# Altium schematic sheet Optocoupler.SchDoc: Optocoupler
size A3; Author: M.Beldyga; CompanyName: WUT ISE; DrawnBy: M.Beldyga; Organization: WUT ISE; Address1: PW ISE; Address2: Nowowiejska 15/19 00-665 Warsaw; Address3: micbeldyga@gmail.com; SheetNumber: 2; SheetTotal: 2; ModifiedBy: -; CheckedDate: -; DivGrp: WUT ISE; Designer: M.Beldyga; ModifiedDate: -; ProjectName: Sensor Box
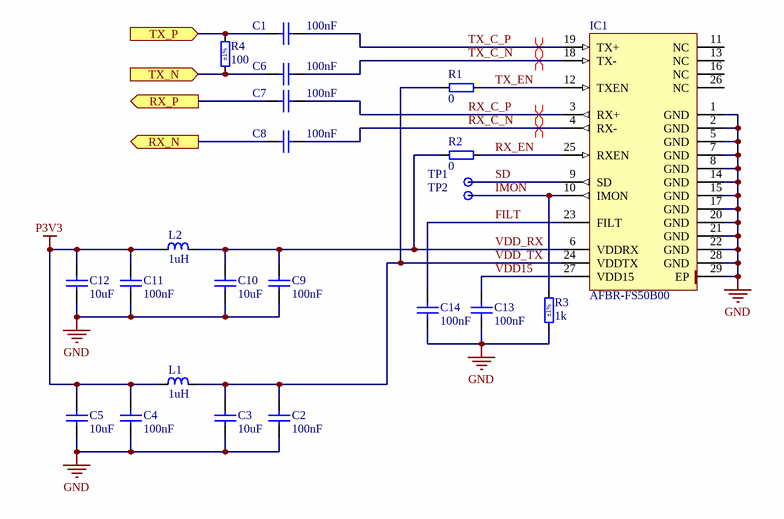
[diagram p0: Optocoupler.SchDoc]

## Parts
C1  100nF  [CAPC1005X55N]
C2  100nF  [CAPC1005X55N]
C3  10uF  [CAPC1005X55N]
C4  100nF  [CAPC1005X55N]
C5  10uF  [CAPC1005X55N]
C6  100nF  [CAPC1005X55N]
C7  100nF  [CAPC1005X55N]
C8  100nF  [CAPC1005X55N]
C9  100nF  [CAPC1005X55N]
C10  10uF  [CAPC1005X55N]
C11  100nF  [CAPC1005X55N]
C12  10uF  [CAPC1005X55N]
C13  100nF  [CAPC1005X55N]
C14  100nF  [CAPC1005X55N]
IC1  AFBR-FS50B00  [BROADCOM_AFBR-FS50B00]
L1  1uH  [INDC1005X55N]
L2  1uH  [INDC1005X55N]
R1  0  [RESC1005X40N]
R2  0  [RESC1005X40N]
R3  1k  Tolerance: ±1%  [RESC1005X40N]
R4  100  Tolerance: ±1%  [RESC1005X40N]
TP1  Test Point  [TPS127]  (value not drawn)
TP2  Test Point  [TPS127]  (value not drawn)

## Ports
RX_N (out), RX_P (out), TX_N (in), TX_P (in)

## Nets
GND: C2.1 C3.1 C4.1 C5.1 C9.1 C10.1 C11.1 C12.1 C13.1 C14.1 IC1.1(GND) IC1.2(GND) IC1.5(GND) IC1.7(GND) IC1.8(GND) IC1.14(GND) IC1.15(GND) IC1.17(GND) IC1.20(GND) IC1.21(GND) IC1.22(GND) IC1.28(GND) IC1.29(EP) R3.1
P3V3: C4.2 C5.2 C11.2 C12.2 L1.2 L2.2
FILT: C14.2 IC1.23(FILT)
IMON: IC1.10(IMON) R3.2 TP2.1
RX_C_N: C8.1 IC1.4(RX-)
RX_C_P: C7.1 IC1.3(RX+)
RX_EN: IC1.25(RXEN) R2.2
RX_N: C8.2 ; port RX_N
RX_P: C7.2 ; port RX_P
SD: IC1.9(SD) TP1.1
TX_C_N: C6.1 IC1.18(TX-)
TX_C_P: C1.1 IC1.19(TX+)
TX_EN: IC1.12(TXEN) R1.2
TX_N: C6.2 R4.1 ; port TX_N
TX_P: C1.2 R4.2 ; port TX_P
VDD15: C13.2 IC1.27(VDD15)
VDD_RX: C9.2 C10.2 IC1.6(VDDRX) L2.1 R2.1
VDD_TX: C2.2 C3.2 IC1.24(VDDTX) L1.1 R1.1

Not connected (* = marked no-connect by the designer): IC1 11(NC) 13(NC) 16(NC) 26(NC)

## Layout directives
differential pair; net class D100: RX_C_N, RX_C_P, TX_C_N, TX_C_P

## Notes on the sheet
- Project/Equipment
- Document
- Designer
- Drawn by
- Check.by
- Contact
- File
- Last Mod.
- Print Date
- Sheet
- Size
- A3
- of
- Rev

## Library data of the parts
C1 C2 C4 C6-C9 C11 C13 C14 = CC0402_100NF_50V_10%_X7R: Non-polarised capacitor; Part Description: SMD Multilayer Chip Ceramic Capacitor; Manufacturer: GENERIC; Manufacturer1 Part Number: GRM155R71H104KE14D; Voltage: 50V; TC: X7R; Tolerance: ±10%; Part Number: CC0402_100NF_50V_10%_X7R; Component Kind: Standard; Component Type: Standard; Pin Count: 2; Value: 100nF; Status: None; Manufacturer Part Number: CC0402_100NF_50V_10%_X7R; Case: 0402; Mounted: Yes; Socket: No; SMD: Yes; Sense: No; Manufacturer1 Example: MURATA; Manufacturer1 ComponentHeight: 0.55mm; HelpURL: \\cern.ch\dfs\Applications\Altium\Datasheets\CC0402_MURATA_GRM155R71H104KE14D.pdf; Author: CERN DEM MR; CreateDate: 6/30/2017; LatestRevisionDate: 6/30/2017
C3 C5 C10 C12 = CC0402_10UF_6.3V_20%_X5R: SMD Mulitlayer Ceramic Chip Capacitor; Manufacturer: GENERIC; Manufacturer 1: Murata; Manufacturer 1 Part Number: GRM155R60J106ME15D; Manufacturer 2 Part Number: CL05A106MQ5NUNC; Manufacturer 3 Part Number: CC0402MRX5R5BB106; Voltage: 6.3V; TC: X5R; Tolerance: ±20%; Part Number: CC0402_10UF_6.3V_20%_X5R; Component Kind: Standard; Component Type: Standard; Pin Count: 2; Value: 10uF; Manufacturer Part Number: CC0402_10UF_6.3V_20%_X5R; Case: 0402; Status: None; ComponentHeight: 0.55mm; SMD: Yes; Manufacturer 2: Samsung; Manufacturer 3: YAGEO; Author: Michal Beldyga; CreateDate: 10/28/2024; LatestRevisionDate: 10/28/2024
IC1 = AFBR-FS50B00: High Voltage Galvanic Insulation Link for DC to 5MBaud; Part Description: Transceiver Module Optical 5Gbps 3.3V Surface Mount; Manufacturer: BROADCOM; PressFit: No; Bonding: No; Part Number: AFBR-FS50B00; Component Kind: Standard; Component Type: Standard; Device: AFBR-FS50B00; PackageDescription: BROADCOM AFBR-FS50B00 Case, Body 5.25mm L X 5.25mm W X 4.83mm H; Manufacturer Part Number: AFBR-FS50B00; Pin Count: 29; Mounted: Yes; Socket: No; SMD: No; Sense: No; ComponentHeight: 4.83mm; HelpURL: \\cern.ch\dfs\Applications\Altium\Datasheets\AFBR-FS50B00.pdf; Author: CERN DEM HF; CreateDate: 12/10/2024; LatestRevisionDate: 12/10/2024
L1 L2 = IND0402_1UH_5%_TDK_MLZ1005M1R0WT000: Inductor; Part Description: FIXED IND 1UH 450MA 350 MOHM SMD; Manufacturer: TDK; Current: 100mA; DC Resistance: 350mΩ; Tolerance: ±20%; Part Number: IND0402_1UH_5%_TDK_MLZ1005M1R0WT000; Component Kind: Standard; Component Type: Standard; Pin Count: 2; Value: 1uH; Manufacturer Part Number: MLZ1005M1R0WT000; Status: Active; ComponentHeight: 0.5mm; SMD: Yes; Author: Michal Beldyga; CreateDate: 2/17/2025; LatestRevisionDate: 2/17/2025
R1 R2 = R0402_0R_JUMPER: Resistor; Part Description: 1A (0.05R Max DC Resistance) Zero Ohm Jumper; Manufacturer: GENERIC; Manufacturer1 Part Number: 232270591001L; PressFit: No; Part Number: R0402_0R_JUMPER; Component Kind: Standard; Component Type: Standard; Pin Count: 2; Value: 0; Status: Not Recommended; Manufacturer Part Number: R0402_0R_JUMPER; Case: 0402; Mounted: Yes; Sense: No; Socket: No; SMD: Yes; Manufacturer1 Example: YAGEO PHYCOMP; Manufacturer1 ComponentHeight: 0.4mm; HelpURL: \\cern.ch\dfs\Applications\Altium\Datasheets\R0402_Phycomp_RC0402.pdf; Author: CERN DEM JLC; CreateDate: 12/3/2007; LatestRevisionDate: 10/17/2012
R3 = R0402_1K_1%_0.0625W_100PPM: Resistor - 1%; Part Description: General Purpose Thick Film Chip Resistor; Manufacturer: GENERIC; Manufacturer1 Part Number: 232270671002L; TC: ±100ppm/°C; PressFit: No; Part Number: R0402_1K_1%_0.0625W_100PPM; Component Kind: Standard; Component Type: Standard; Pin Count: 2; Value: 1k; Status: Not Recommended; Power: 0.0625W; Manufacturer Part Number: R0402_1K_1%_0.0625W_100PPM; Case: 0402; Mounted: Yes; Sense: No; Socket: No; SMD: Yes; Manufacturer1 Example: YAGEO PHYCOMP; Manufacturer1 ComponentHeight: 0.4mm; HelpURL: \\cern.ch\dfs\Applications\Altium\Datasheets\R0402_Phycomp_RC0402.pdf; Author: CERN DEM JLC; CreateDate: 12/3/2007; LatestRevisionDate: 10/17/2012
R4 = R0402_100R_1%_0.1W_100PPM: Resistor - 1%; Part Description: General Purpose Thick Film Chip Resistor; Manufacturer: GENERIC; Manufacturer Part Number: R0402_100R_1%_0.1W_100PPM_50V; Manufacturer1 Part Number: ERJ2RKF1000X; Power: 0.1W; TC: ±100ppm/°C; Voltage: 50V; PressFit: No; Part Number: R0402_100R_1%_0.1W_100PPM; Component Kind: Standard; Component Type: Standard; Pin Count: 2; Value: 100; Status: Not Recommended; Case: 0402; Mounted: Yes; Sense: No; Socket: No; SMD: Yes; Manufacturer1 Example: PANASONIC; Manufacturer1 ComponentHeight: 0.4mm; HelpURL: \\cern.ch\dfs\Applications\Altium\Datasheets\R0402_PANASONIC_ERJ2RK.pdf; Author: CERN DEM JLC; CreateDate: 12/12/2013; LatestRevisionDate: 3/3/2015
TP1 TP2 = SMD_PAD_1.27X1.27MM: Part Description: 1.27mm x 1.27mm PCB Copper Area (SMD Test Point); Mounted: No; Part Number: SMD_PAD_1.27X1.27MM; Component Kind: Standard (No BOM); Component Type: Standard (No BOM); Pin Count: 1; Family: Test Point; Socket: No; SMD: Yes; Sense: No; Status: None; ComponentHeight: 0mm; HelpURL: Undefined; Author: CERN DEM JLC; CreateDate: 1/12/2008; LatestRevisionDate: 1/12/2008; PackageDescription: 1.27mm x 1.27mm PCB Copper Area (SMD Test Point)